# EAGLE design fader_ver2 (EAGLE 7.2.0)
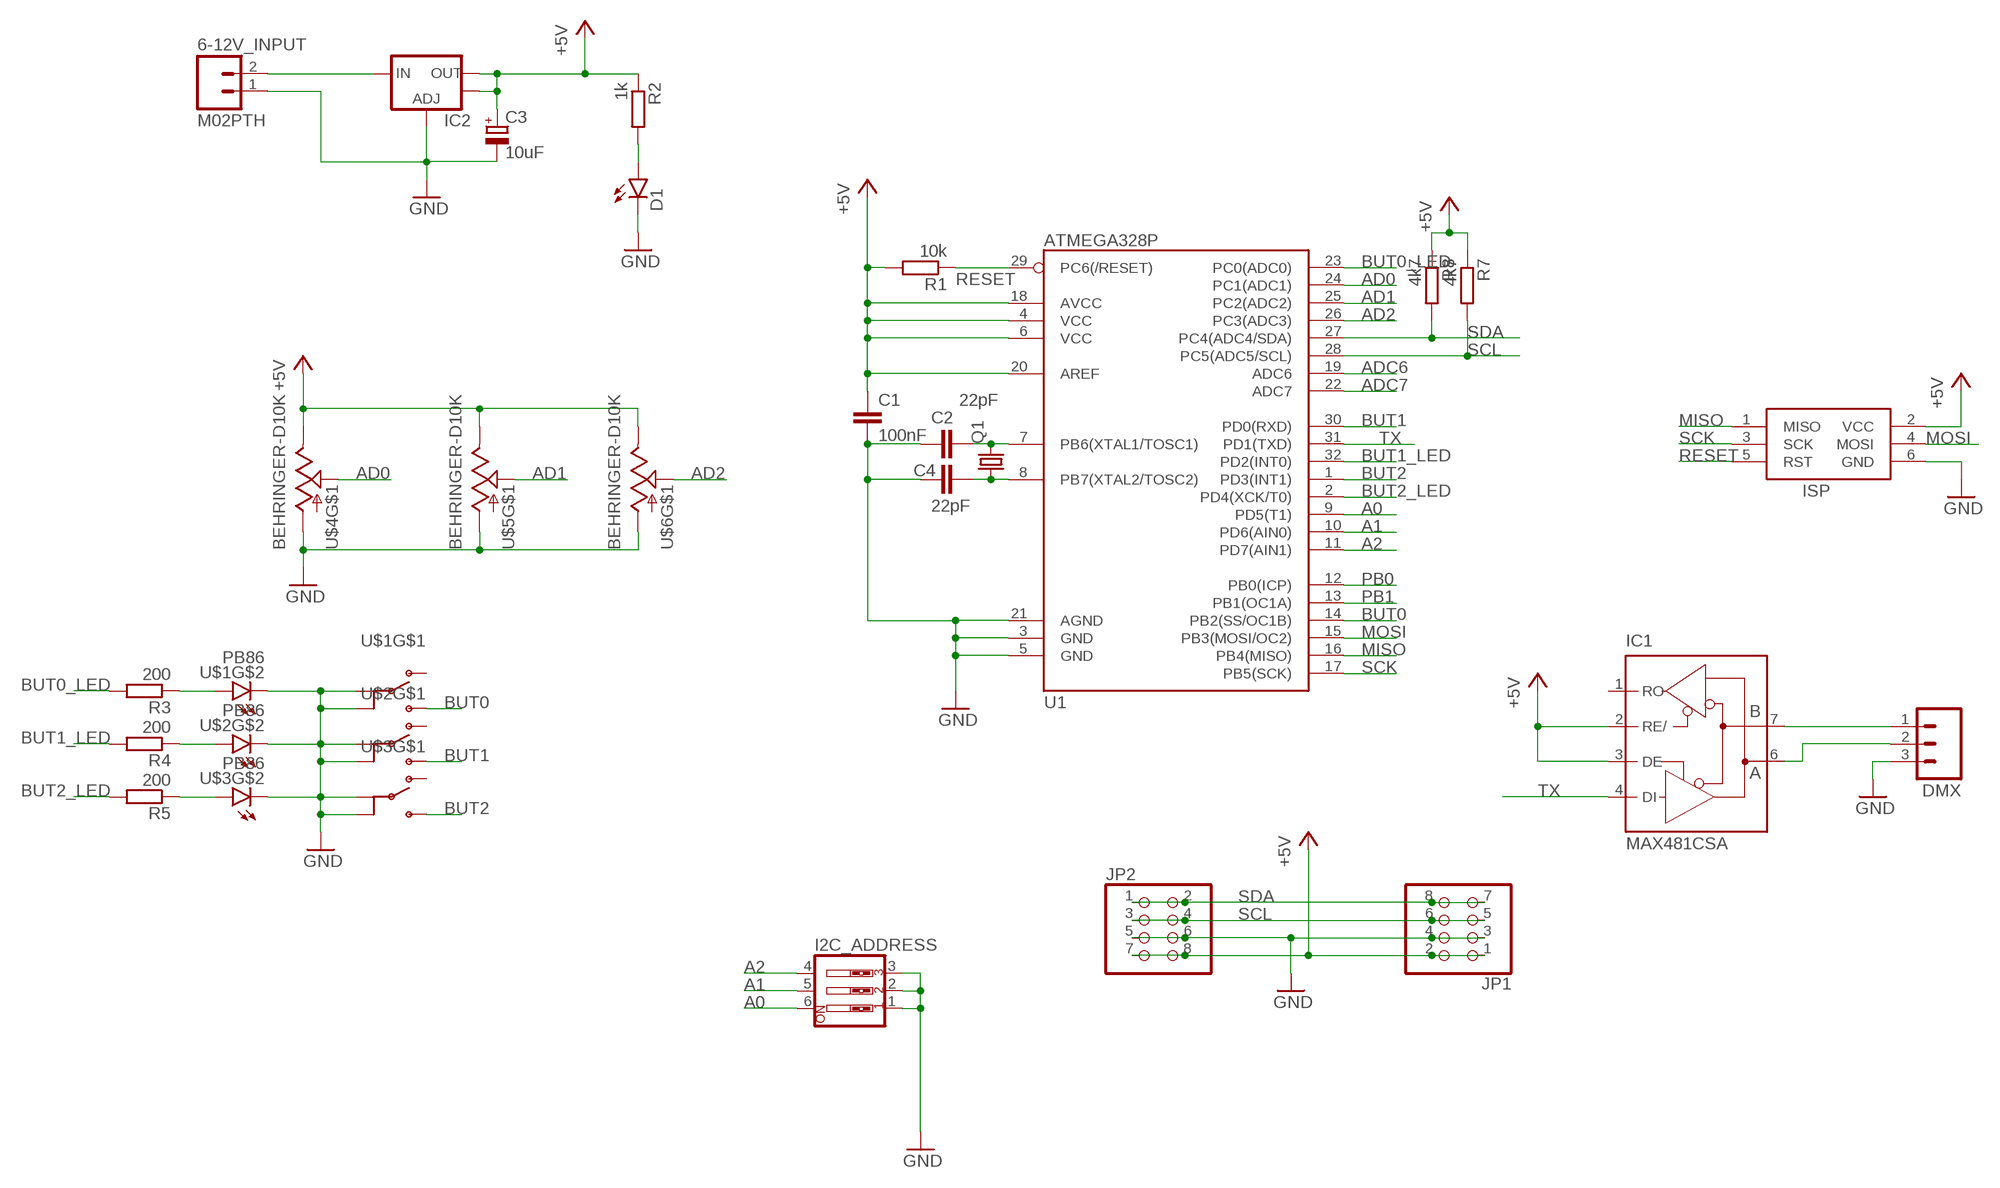
[diagram p0: schematic, sheet 1]

## Parts
6-12V_INPUT  M02PTH  [1X02]
C1  100nF  C-EUC0603  [C0603]
C2  22pF  C-EUC0603  [C0603]
C3  10uF  CPOL-EUCT6032  [CT6032]
C4  22pF  C-EUC0603  [C0603]
D1  LED  [LED-3528MM]
DMX  M03PTH  [1X03]
I2C_ADDRESS  SW_DIP-3  [EDG-03]
IC1  MAX481CSA  [SO08]
IC2  V_REG_LM1117SOT223  [SOT223]
ISP  AVRISP-6  [AVRISP]
JP1  PINHD-2X4/90  [2X04/90]
JP2  PINHD-2X4/90  [2X04/90]
Q1  CRYSTALHC49UP  [HC49UP]
R1  10k  R-EU_R0603  [R0603]
R2  1k  R-EU_R0603  [R0603]
R3  200  R-EU_R0603  [R0603]
R4  200  R-EU_R0603  [R0603]
R5  200  R-EU_R0603  [R0603]
R7  4k7  R-EU_R0603  [R0603]
R8  4k7  R-EU_R0603  [R0603]
U1  ATMEGA328P  ATMEGA328_SMT  [TQFP32-08]
U$1  PB86  [PB86]
U$2  PB86  [PB86]
U$3  PB86  [PB86]
U$4  BEHRINGER-D10K  [BEHRINGER_D10K]
U$5  BEHRINGER-D10K  [BEHRINGER_D10K]
U$6  BEHRINGER-D10K  [BEHRINGER_D10K]

## Nets
A0: I2C_ADDRESS.6 U1.9(PD5(T1))
A1: I2C_ADDRESS.5 U1.10(PD6(AIN0))
A2: I2C_ADDRESS.4 U1.11(PD7(AIN1))
AD0: U1.24(PC1(ADC1)) U$4.P$2
AD1: U1.25(PC2(ADC2)) U$5.P$2
AD2: U1.26(PC3(ADC3)) U$6.P$2
ADC6: U1.19(ADC6)
ADC7: U1.22(ADC7)
BUT0: U1.14(PB2(SS/OC1B)) U$1.2(NO)
BUT0_LED: R3.2 U1.23(PC0(ADC0))
BUT1: U1.30(PD0(RXD)) U$2.2(NO)
BUT1_LED: R4.2 U1.32(PD2(INT0))
BUT2: U1.1(PD3(INT1)) U$3.2(NO)
BUT2_LED: R5.2 U1.2(PD4(XCK/T0))
GND: 6-12V_INPUT.1 C1.2 C2.1 C3.- C4.1 D1.C DMX.3 I2C_ADDRESS.1 I2C_ADDRESS.2 I2C_ADDRESS.3 IC2.1(ADJ) ISP.6(GND) JP1.3 JP1.4 JP2.5 JP2.6 U1.3(GND) U1.5(GND) U1.21(AGND) U$1.1_1(IN1) U$1.1_2(IN2) U$1.L3(C) U$2.1_1(IN1) U$2.1_2(IN2) U$2.L3(C) U$3.1_1(IN1) U$3.1_2(IN2) U$3.L3(C) U$4.P$3 U$5.P$3 U$6.P$3
MISO: ISP.1(MISO) U1.16(PB4(MISO))
MOSI: ISP.4(MOSI) U1.15(PB3(MOSI/OC2))
N$1: 6-12V_INPUT.2 IC2.3(IN)
N$2: DMX.1 IC1.7(B)
N$3: DMX.2 IC1.6(A)
N$4: C2.2 Q1.2 U1.7(PB6(XTAL1/TOSC1))
N$5: C4.2 Q1.1 U1.8(PB7(XTAL2/TOSC2))
N$7: D1.A R2.2
N$8: R3.1 U$1.L2(A)
N$9: R4.1 U$2.L2(A)
N$10: R5.1 U$3.L2(A)
PB0: U1.12(PB0(ICP))
PB1: U1.13(PB1(OC1A))
RESET: ISP.5(RST) R1.1 U1.29(PC6(/RESET))
SCK: ISP.3(SCK) U1.17(PB5(SCK))
SCL: JP1.5 JP1.6 JP2.3 JP2.4 R7.2 U1.28(PC5(ADC5/SCL))
SDA: JP1.7 JP1.8 JP2.1 JP2.2 R8.2 U1.27(PC4(ADC4/SDA))
TX: IC1.4(DI) U1.31(PD1(TXD))
VCC: C1.1 C3.+ IC1.2(RE/) IC1.3(DE) IC2.2(OUT) IC2.4(OUT) ISP.2(VCC) JP1.1 JP1.2 JP2.7 JP2.8 R1.2 R2.1 R7.1 R8.1 U1.4(VCC) U1.6(VCC) U1.18(AVCC) U1.20(AREF) U$4.P$5 U$5.P$5 U$6.P$5 ; supply symbol labelled +5V
Unconnected: IC1.1(RO) U$1.3(NC) U$2.3(NC) U$3.3(NC) U$4.P$1 U$4.P$4 U$4.P$6 U$5.P$1 U$5.P$4 U$5.P$6 U$6.P$1 U$6.P$4 U$6.P$6

## Power pins joined to a net without a drawn wire
GND: IC1.5(GND)
VCC: IC1.8(VCC)

## Library data of the parts
6-12V_INPUT = SparkFun-Connectors:M02: Standard 2-pin 0.1" header. Use with - straight break away headers ( PRT-00116) - right angle break away headers (PRT-00553) - swiss pins (PRT-00743) - machine pins (PRT-00117) - female headers (PRT-00115) Molex polarized connector foot print use with: PRT-08233 with associated crimp pins and housings. 2.54_SCREWTERM for use with PRT-10571. 3.5mm Screw Terminal footprints for PRT-08084 5mm Screw Terminal footprints for use with PRT-08432
C1 C2 C4 = rcl:C-EU: CAPACITOR, European symbol
C3 = rcl:CPOL-EU: POLARIZED CAPACITOR, European symbol
D1 = BauckLib:LED: Assorted Red LEDs LilyPad 1206- DIO-09912 1206- DIO-00809 0603- DIO-00819
DMX = SparkFun-Connectors:M03: Header 3 Standard 3-pin 0.1" header. Use with straight break away headers (SKU : PRT-00116), right angle break away headers (PRT-00553), swiss pins (PRT-00743), machine pins (PRT-00117), and female headers (PRT-00115). Molex polarized connector foot print use with SKU : PRT-08232 with associated crimp pins and housings.
I2C_ADDRESS = special:SW_DIP-3: DIP SWITCH
IC1 = maxim:MAX481CSA: RS485 TRANSEIVER; MF: MAXIM; MPN: MAX481CSA; OC_FARNELL: unknown; OC_NEWARK: 90C3817
IC2 = SparkFun-PowerIC:V_REG_LM1117: Voltage Regulator LM1117 Standard adjustable voltage regulator but in SMD form. Spark Fun Electronics SKU : COM-00595
ISP = BauckLib:AVRISP: AVR ISP HEADER Standard 6 pin header for AVR programming
JP1 JP2 = pinhead:PINHD-2X4: PIN HEADER
Q1 = crystal:CRYSTAL: CRYSTAL; OC_FARNELL: unknown; OC_NEWARK: unknown
R1-R5 R7 R8 = rcl:R-EU_: RESISTOR, European symbol
U1 = SparkFun-DigitalIC:ATMEGA328_SMT: 32-Pin Atmega328 part Commonly used on Arduino compatible boards Available in QFP and QFN packages TQFP is IC-09069 QFN is non-stock; PROD_ID: IC-09069
U$1-U$3 = BauckLib:PB86
U$4-U$6 = BauckLib:BEHRINGER-D10K

## Board
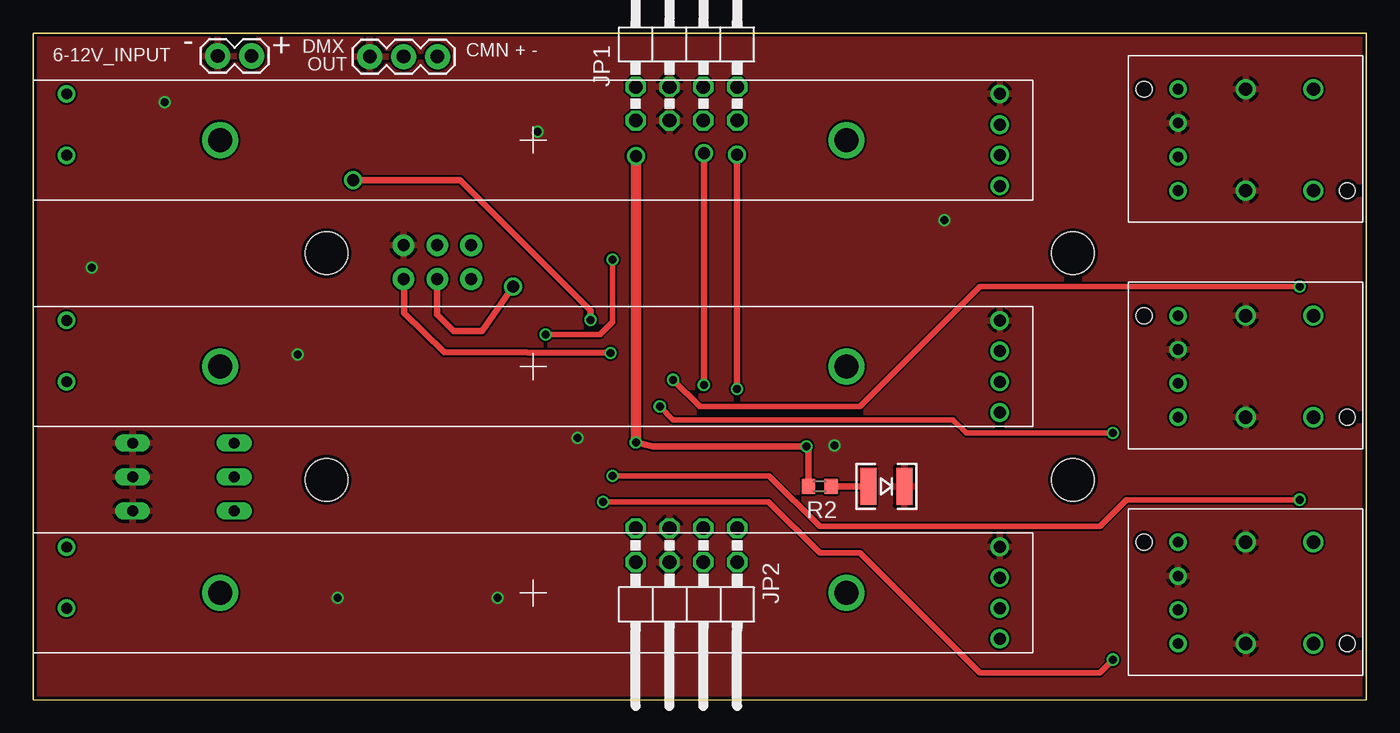
[diagram p1: board, top side]
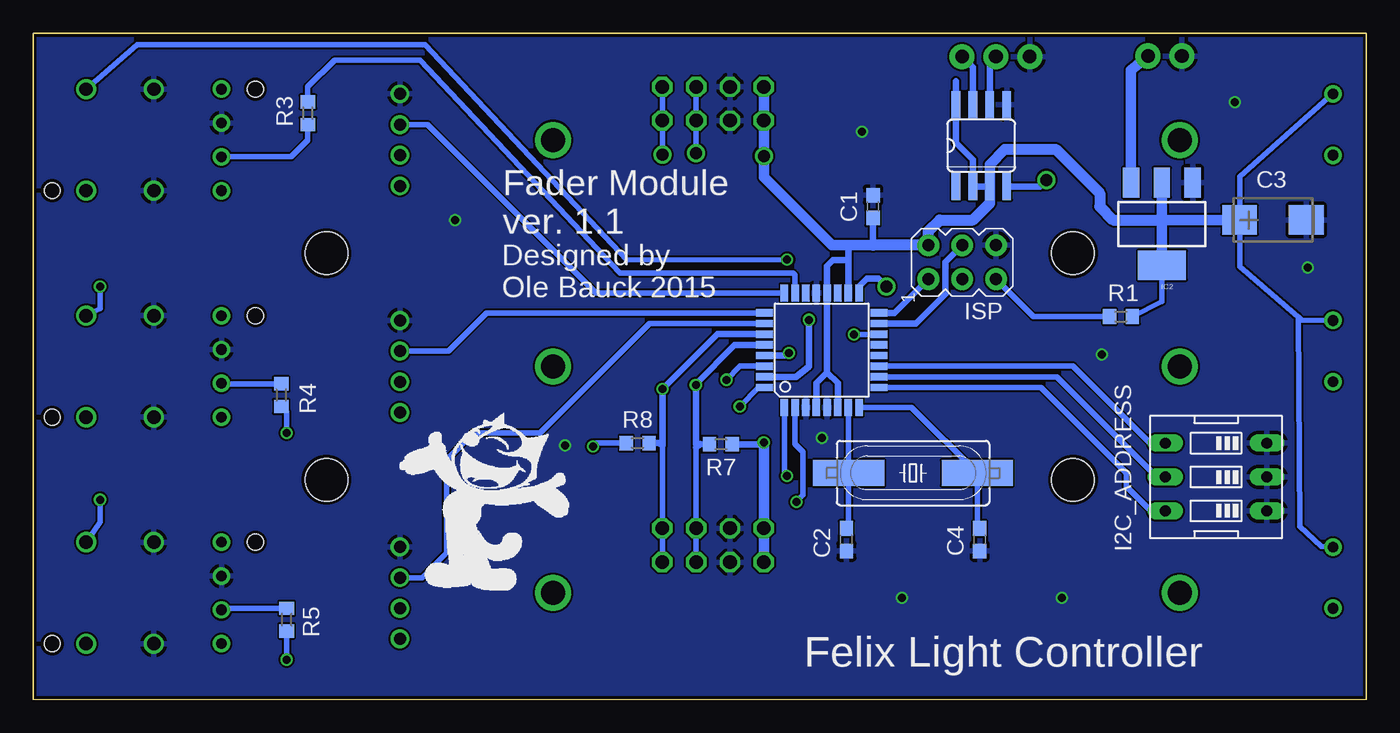
[diagram p2: board, bottom side, seen from below]

Size 100 x 50 mm. Coordinates in mm from the lower left corner, seen from the top.
Outline: 100,0 100,50 0,50 0,0 100,0
Copper layers (1*16): Top 0.035mm / dielectric 1.5mm / Bottom 0.035mm
Design rules "Elecrow_2-layer_eagle_rule": minimum track width 6mil, minimum drill 12mil, track to track 6mil, track to pad 6mil, pad to pad 6mil, via to via 6mil, smd to smd 0mil, copper to edge 10mil, drill to drill 10mil, minimum pad ring 10mil, minimum via ring 6mil, stop-mask expansion 2mil, vias tented up to drill 100mil, thermal gap 10mil
Holes 3.2 mm at 78,16.5 78,33.5 22,16.5 22,33.5
Milling: 4 lines

### Footprints (pad centres in the part's own frame; a part is rotated, then mirrored left to right if it is on the bottom)
1X02 = drill 1.016 pad 1.88: 1 0,0; 2 2.54,0
C0603 = smd 1.1 x 1: 1 -0.85,0; 2 0.85,0
CT6032 = smd 2.6 x 2.2: + -2.5,0; - 2.5,0
LED-3528MM = smd 1.2 x 2.8: A -1.35,0; C 1.35,0
1X03 = drill 1.016 pad 1.88: 1 0,0; 2 2.54,0; 3 5.08,0
EDG-03 = drill 0.813 long: 1 -2.54,-3.81; 2 0,-3.81; 3 2.54,-3.81; 4 2.54,3.81; 5 0,3.81; 6 -2.54,3.81
SO08 = smd 0.66 x 2.032: 1 -1.905,-3.073; 2 -0.635,-3.073; 3 0.635,-3.073; 4 1.905,-3.073; 5 1.905,3.073; 6 0.635,3.073; 7 -0.635,3.073; 8 -1.905,3.073
SOT223 = smd 1.219 x 2.235: 1 -2.311,-3.099; 2 0,-3.099; 3 2.311,-3.099 | smd 3.6 x 2.2: 4 0,3.099
AVRISP = drill 0.9 pad 1.626: 1 -1.27,2.54; 2 1.27,2.54; 3 -1.27,0; 4 1.27,0; 5 -1.27,-2.54; 6 1.27,-2.54
2X04/90 = drill 1.016 octagon: 1 -3.81,-6.35; 2 -3.81,-3.81; 3 -1.27,-6.35; 4 -1.27,-3.81; 5 1.27,-6.35; 6 1.27,-3.81; 7 3.81,-6.35; 8 3.81,-3.81
HC49UP = smd 5.334 x 1.93: 1 -4.826,0; 2 4.826,0
R0603 = smd 1 x 1.1: 1 -0.85,0; 2 0.85,0
TQFP32-08 = smd 1.27 x 0.559: 1 -4.293,2.8; 2 -4.293,2; 3 -4.293,1.2; 4 -4.293,0.4; 5 -4.293,-0.4; 6 -4.293,-1.2; 7 -4.293,-2; 8 -4.293,-2.8; 17 4.293,-2.8; 18 4.293,-2; 19 4.293,-1.2; 20 4.293,-0.4; 21 4.293,0.4; 22 4.293,1.2; 23 4.293,2; 24 4.293,2.8 | smd 0.559 x 1.27: 9 -2.8,-4.293; 10 -2,-4.293; 11 -1.2,-4.293; 12 -0.4,-4.293; 13 0.4,-4.293; 14 1.2,-4.293; 15 2,-4.293; 16 2.8,-4.293; 25 2.8,4.293; 26 2,4.293; 27 1.2,4.293; 28 0.4,4.293; 29 -0.4,4.293; 30 -1.2,4.293; 31 -2,4.293; 32 -2.8,4.293
PB86 = drill 1: 1_1 -3.81,2.54; 1_2 3.81,2.54; 2 3.81,-2.54; 3 -3.81,-2.54 | drill 0.8: L1 -3.81,7.62; L2 -1.27,7.62; L3 1.27,7.62; L4 3.81,7.62 | hole 1.2: 3.81,10.16; -3.81,-5.08
BEHRINGER_D10K = drill 0.9: P$1 -1.15,-35; P$2 1.15,-35; P$3 3.45,-35; P$4 -3.45,-35 | drill 0.8: P$5 3.45,35; P$6 -1.15,35 | drill 1.8: P$7 0,-23.5; P$8 0,23.5

### Placement (x,y rotation side)
6-12V_INPUT  13.83,48.3 0 top
C1  37,37 90 bottom
C2  39,12 90 bottom
C3  7,36 0 bottom
C4  29,12 90 bottom
D1  64,16 0 top
DMX  30.32,48.25 180 top
I2C_ADDRESS  11.26,16.7 90 bottom
IC1  28.88,41.58 0 bottom
IC2  15.33,35.69 180 bottom
ISP  30.31,32.82 90 bottom
JP1  49,49.8 0 top
JP2  49,6.5 180 top
Q1  34,17 180 bottom
R1  18.4,28.74 0 bottom
R2  59,16 0 top
R3  79.4,44 90 bottom
R4  81.4,22.84 270 bottom
R5  81,6 270 bottom
R7  48.42,19.16 180 bottom
R8  54.66,19.24 0 bottom
U1  40.85,26.22 90 bottom
U$1  93.5,42 90 top
U$2  93.5,25 90 top
U$3  93.5,8 90 top
U$4  37.5,42 90 top
U$5  37.5,25 90 top
U$6  37.5,8 90 top
U$7  [FELIX]  72.49,8.21 0 bottom

### Tracks (layer width: path | path; a pad name or v marks a point on that pad's centre or on a via)
A0
  Bottom 0.406: U1.9 24.42,23.42 18,17 18,16 16.16,14.16 I2C_ADDRESS.6
A1
  Bottom 0.406: U1.10 23.22,24.22 15.7,16.7 I2C_ADDRESS.5
A2
  Bottom 0.406: U1.11 22.02,25.02 16.24,19.24 I2C_ADDRESS.4
AD0
  Bottom 0.406: U1.24 57.76,30.51 70.4,43.15 U$4.P$2
AD1
  Bottom 0.406: U1.25 65.98,29.02 68.85,26.15 U$5.P$2
AD2
  Bottom 0.406: U1.26 53.78,28.22 62,20 67,20 69,18 69,11 70.85,9.15 U$6.P$2
ADC6
  Bottom 0.5: 39.64,30.55 39.66,30.55 39.66,30.52 U1.19
BUT0  (via drill 0.6)
  Top 0.406: v43.44,33.02 43.44,28.33 42.51,27.4 v38.42,27.4
  Bottom 0.406: U$1.2 92.21,49.14 70.61,49.14 55.47,33 v43.44,33.02 | v38.42,27.4 36.58,27.4 U1.14
BUT0_LED
  Bottom 0.406: U1.23 42.85,31.85 43,32 56,32 71,48 77.4,48 79.4,46 R3.2
BUT1  (via drill 0.6)
  Top 0.406: v48,24 50,22 62,22 71,31 v95,31
  Bottom 0.406: U1.30 46.98,25.02 v48,24 | v95,31 95,29.35 U$2.2
  Bottom 0.5: U1.30 45.11,25
BUT1_LED  (via drill 0.6)
  Top 0.406: v47,22 48,21 69,21 70,20 v81,20
  Bottom 0.406: U1.32 45.58,23.42 v47,22 | v81,20 81,21.59 R4.2
BUT2  (via drill 0.6)
  Top 0.406: v43.47,16.79 55.21,16.79 59,13 80,13 82,15 v95,15
  Bottom 0.406: 43.66,21.92 43.66,16.98 v43.47,16.79 | v95,15 95,13.35 U$3.2
  Bottom 0.5: 43.66,21.92 U1.1
BUT2_LED  (via drill 0.6)
  Top 0.406: v42.75,14.84 55.16,14.84 59,11 62,11 71,2 80,2 v81,3
  Bottom 0.406: U1.2 42.85,19.19 42.25,18.59 42.25,15.34 v42.75,14.84 | v81,3 R5.2
  Bottom 0.5: U1.2 42.84,21.91
GND  (via drill 0.6)
  other vias: 40.82,19.63 34.82,7.63 22.82,7.63 37.82,42.63 68.34,35.97 60.11,19.07 9.87,44.83 4.39,32.42 19.84,25.89
  pour Bottom: -2,52 101,52 100,-2 -2,-2
  pour Top: -5,53 103,52 101,-2 -5,-2
MISO
  Bottom 0.5: U1.16 35.38,29.02 ISP.1
MOSI
  Bottom 0.5: U1.15 33.78,28.22 31.58,30.44 31.58,32.84 ISP.4
N$1
  Bottom 0.8: IC2.3 17.64,47.22 6-12V_INPUT.2
N$2
  Bottom 0.5: IC1.7 29.52,47.45 DMX.1
N$3
  Bottom 0.5: IC1.6 28.25,47.78 DMX.2
N$4
  Bottom 0.406: U1.7 38.85,17.02 Q1.2 38.83,13.02 C2.2
N$5
  Bottom 0.406: U1.8 34.1,21.93 Q1.1 29.17,13.02 C4.2
N$7
  Top 0.5: D1.A R2.2
N$8
  Bottom 0.406: U$1.L2 80.67,40.73 79.4,42 R3.1
N$9
  Bottom 0.406: R4.1 85.34,23.69 U$2.L2
N$10
  Bottom 0.406: R5.1 85.26,6.85 U$3.L2
PB1
  Bottom 0.5: 36.61,26.62 U1.13
RESET  (via drill 0.6)
  Top 0.5: v43.3,26 30.8,26.1 27.8,29 27.8,31.48 ISP.5
  Bottom 0.406: R1.1 22.97,28.75 24.97,28.75 ISP.5
  Bottom 0.5: v43.3,26 43.48,25.82 U1.29
SCK  (via drill 0.9)
  Top 0.5: v36,31 33.67,27.67 31.53,27.67 30.31,28.89 ISP.3
  Bottom 0.5: U1.17 38.05,30.98 37.44,31.59 36.59,31.59 v36,31
SCL  (via drill 0.6, 0.9)
  Top 0.5: v50.3,41 v50.3,23.6
  Bottom 0.406: 50.27,18.91 JP2.3 JP2.4 | 50.27,41.03 JP1.5 JP1.6
  Bottom 0.5: U1.28 47.38,26.62 50.3,23.7 v50.3,23.6 50.3,19.19 49.99,19.18 | 50.27,41.03 v50.3,41 | 49.99,19.18 R7.2 | 50.27,18.91 49.99,19.18
SDA  (via drill 0.6, 0.9)
  Top 0.5: v52.8,40.9 v52.8,23.3
  Bottom 0.406: 52.81,19.06 JP2.1 JP2.2 | v52.81,40.91 JP1.7 JP1.8
  Bottom 0.5: U1.27 48.68,27.42 v52.81,23.29 52.8,23.28 v52.8,23.3 52.8,19.25 53,19.25 | v52.81,40.91 v52.8,40.9 | 53,19.25 R8.2 | 52.81,19.06 53,19.25
TX  (via drill 0.6, 0.9)
  Top 0.5: v24,39 32,39 41.8,29.2 v41.8,28.5
  Bottom 0.5: IC1.4 24.49,38.51 v24,39 | v41.8,28.5 41.8,25 42.78,24.22 U1.31
VCC  (via drill 0.6, 0.9)
  Top 0.5: v45.2,19.3 46.5,19 v58,19 58.15,18.85 R2.1
  Top 0.8: v45.2,19.3 v45.2,40.8
  Bottom 0.406: R8.1 57.76,19.24 v58,19 | U$6.P$5 3.38,11.5 5,13 5.11,28.72 | 5.11,28.72 9.5,32.5 C3.+ 9.5,39.25 U$4.P$5 | U$5.P$5 4.86,28.47 5.11,28.72 | IC2.4 15.33,29.86 R1.2
  Bottom 0.5: 28.25,37.24 IC1.3 IC1.2 | C1.1 37,34.09 | U1.18 38.85,33 | 38.85,33 38.85,33.94 39,34.09 | 38.85,33 40,33 40.45,32.55 U1.20 40.45,24.55 | 40.45,24.55 41.25,23.75 U1.4 | 40.45,24.55 39.65,23.75 U1.6 | R7.1 45.34,19.16 v45.2,19.3 | IC1.8 30.79,41.78 29.52,40.52 IC1.2 | IC1.8 30.79,46.41 30.78,46.41 IC1.8 | 29.49,38.48 IC1.2
  Bottom 0.8: IC2.2 15.33,36 | 15.33,36 IC2.4 | 37,34.09 39,34.09 40.09,34.09 45.2,39.2 v45.2,40.8 v45.19,40.81 JP1.1 JP1.2 | v45.2,19.3 45.2,13 | 45.2,13 JP2.8 | 28.25,37.24 28.25,40.16 27.1,41.3 | C3.+ 15.33,36 | JP2.7 45.19,12.99 45.2,13
  Bottom 0.813: 27.1,41.3 23.3,41.3 20,38 20,37 19,36 15.33,36 | 37,34.09 ISP.2 32.85,35.15 32,36 29.49,36 28.25,37.24

### Text on the board
tPlace: - | + | CMN + - | OUT
bPlace: Fader Module / ver. 1.1 | Designed by / Ole Bauck 2015 | Felix Light Controller